# EAGLE design OpAmp_NonInvertente_741xSHUNT-50A (EAGLE 7.2.0)
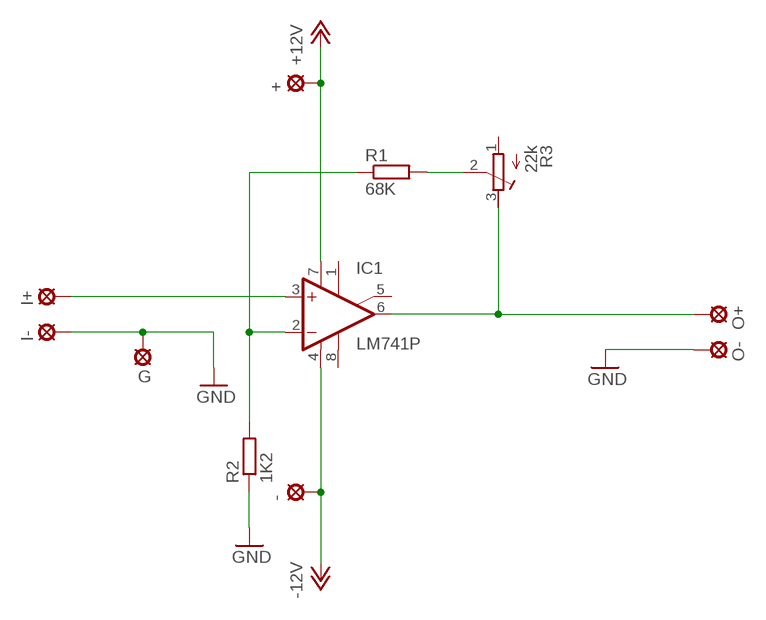
[diagram p0: schematic, sheet 1]

## Parts
+  LSP10  [LSP10]
-  LSP10  [LSP10]
G  LSP10  [LSP10]
I+  LSP10  [LSP10]
I-  LSP10  [LSP10]
IC1  LM741P  [DIL08]
O+  LSP10  [LSP10]
O-  LSP10  [LSP10]
R1  68K  R-EU_0207/12  [0207/12]
R2  1K2  R-EU_0207/12  [0207/12]
R3  22k  R-TRIMM3339P  [RTRIM3339P]

## Nets
+12V: +.MP IC1.7(V+)
-12V: -.MP IC1.4(V-)
GND: G.MP I-.MP O-.MP R2.1
N$1: IC1.2(-IN) R1.1 R2.2
N$2: R1.2 R3.2(S)
N$3: IC1.6(OUT) O+.MP R3.3(E)
N$4: I+.MP IC1.3(+IN)
Unconnected: IC1.1(ON1) IC1.5(ON2) IC1.8(OPT) R3.1(A)

## Library data of the parts
+ - G I+ I- O+ O- = solpad:LSP10: SOLDER PAD drill 1.0 mm, distributor Buerklin, 12H555
IC1 = linear:*741: OP AMP
R1 R2 = resistor:R-EU_: RESISTOR, European symbol
R3 = rcl:R-TRIMM: Trimm resistor

## Board
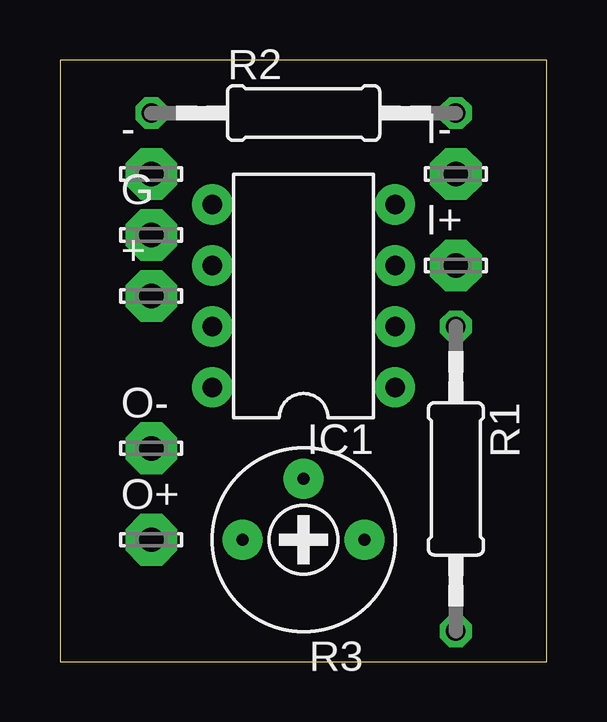
[diagram p1: board, top side]
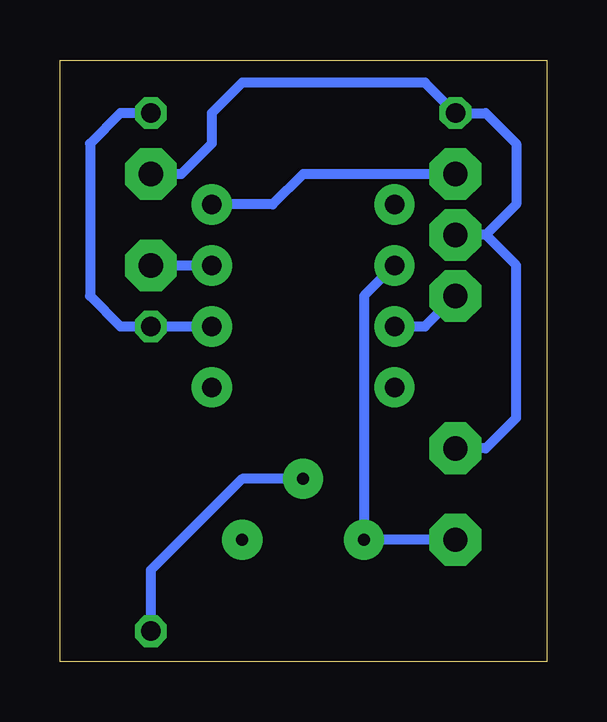
[diagram p2: board, bottom side, seen from below]

Size 20.3 x 25.07 mm. Coordinates in mm from the lower left corner, seen from the top.
Outline: 0,0 20.3,0 20.3,25.07 0,25.07 0,0
Copper layers (1*16): Top 0.035mm / dielectric 1.5mm / Bottom 0.035mm
Design rules "default": minimum track width 10mil, minimum drill 24mil, track to track 8mil, track to pad 8mil, pad to pad 8mil, via to via 8mil, smd to smd 8mil, copper to edge 40mil, drill to drill 8mil, minimum pad ring 10mil, minimum via ring 8mil, stop-mask expansion 4mil, vias tented up to drill 0mil, thermal gap 10mil

### Footprints (pad centres in the part's own frame; a part is rotated, then mirrored left to right if it is on the bottom)
LSP10 = drill 1.016 pad 2.159 octagon: MP 0,0
DIL08 = drill 0.813 pad 1.676: 1 -3.81,-3.81; 2 -1.27,-3.81; 3 1.27,-3.81; 4 3.81,-3.81; 5 3.81,3.81; 6 1.27,3.81; 7 -1.27,3.81; 8 -3.81,3.81
0207/12 = drill 0.813 octagon: 1 -6.35,0; 2 6.35,0
RTRIM3339P = drill 0.5 pad 1.676: 1 -2.54,0; 2 0,-2.54; 3 2.54,0

### Placement (x,y rotation side)
+  3.81,15.24 0 top
-  3.81,20.32 0 top
G  3.81,17.78 0 top
I+  16.51,16.51 0 top
I-  16.51,20.32 0 top
IC1  10.16,15.24 90 top
O+  3.81,5.08 0 top
O-  3.81,8.89 0 top
R1  16.51,7.62 270 top
R2  10.16,22.86 0 top
R3  10.16,5.08 180 top

### Tracks (layer width: path | path; a pad name or v marks a point on that pad's centre or on a via)
+12V
  Bottom 0.406: IC1.7 5.08,13.97 +.MP
-12V
  Bottom 0.406: -.MP 10.16,20.32 11.43,19.05 IC1.4
GND
  Bottom 0.406: I-.MP 15.24,20.32 13.97,21.59 13.97,22.86 12.7,24.13 5.08,24.13 R2.1 2.54,22.86 1.27,21.59 1.27,19.05 2.54,17.78 | 2.54,17.78 1.27,16.51 1.27,10.16 2.54,8.89 O-.MP | 2.54,17.78 G.MP
N$1
  Bottom 0.406: R2.2 17.78,22.86 19.05,21.59 19.05,15.24 17.78,13.97 R1.1 IC1.2
N$2
  Bottom 0.406: R3.2 12.7,7.62 16.51,3.81 R1.2
N$3
  Bottom 0.406: O+.MP R3.3 7.62,15.24 IC1.6
N$4
  Bottom 0.406: I+.MP IC1.3